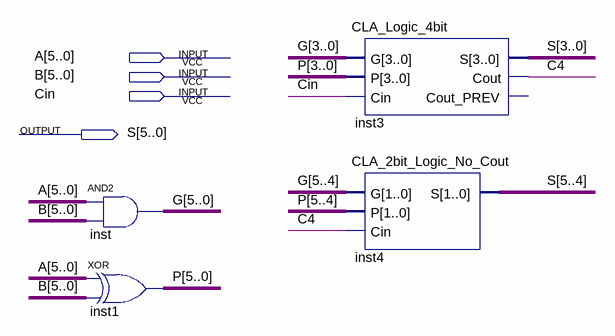
[diagram p0: schematic sheet]
// Quartus schematic CLA_6bit.bdf as structural Verilog: 4 symbols, 4 pins
module CLA_6bit (
  input  [5:0] A,
  input  [5:0] B,
  input  Cin,
  output [5:0] S
);

  wire C4;
  wire [5:0] G, P;

  assign G = A & B;  // AND2 inst, 6 bits wide
  assign P = A ^ B;  // XOR inst1, 6 bits wide
  CLA_Logic_4bit inst3 (.G(G[3:0]), .P(P[3:0]), .Cin(Cin), .S(S[3:0]), .Cout(C4));  // open: Cout_PREV
  CLA_2bit_Logic_No_Cout inst4 (.G(G[5:4]), .P(P[5:4]), .Cin(C4), .S(S[5:4]));
endmodule
